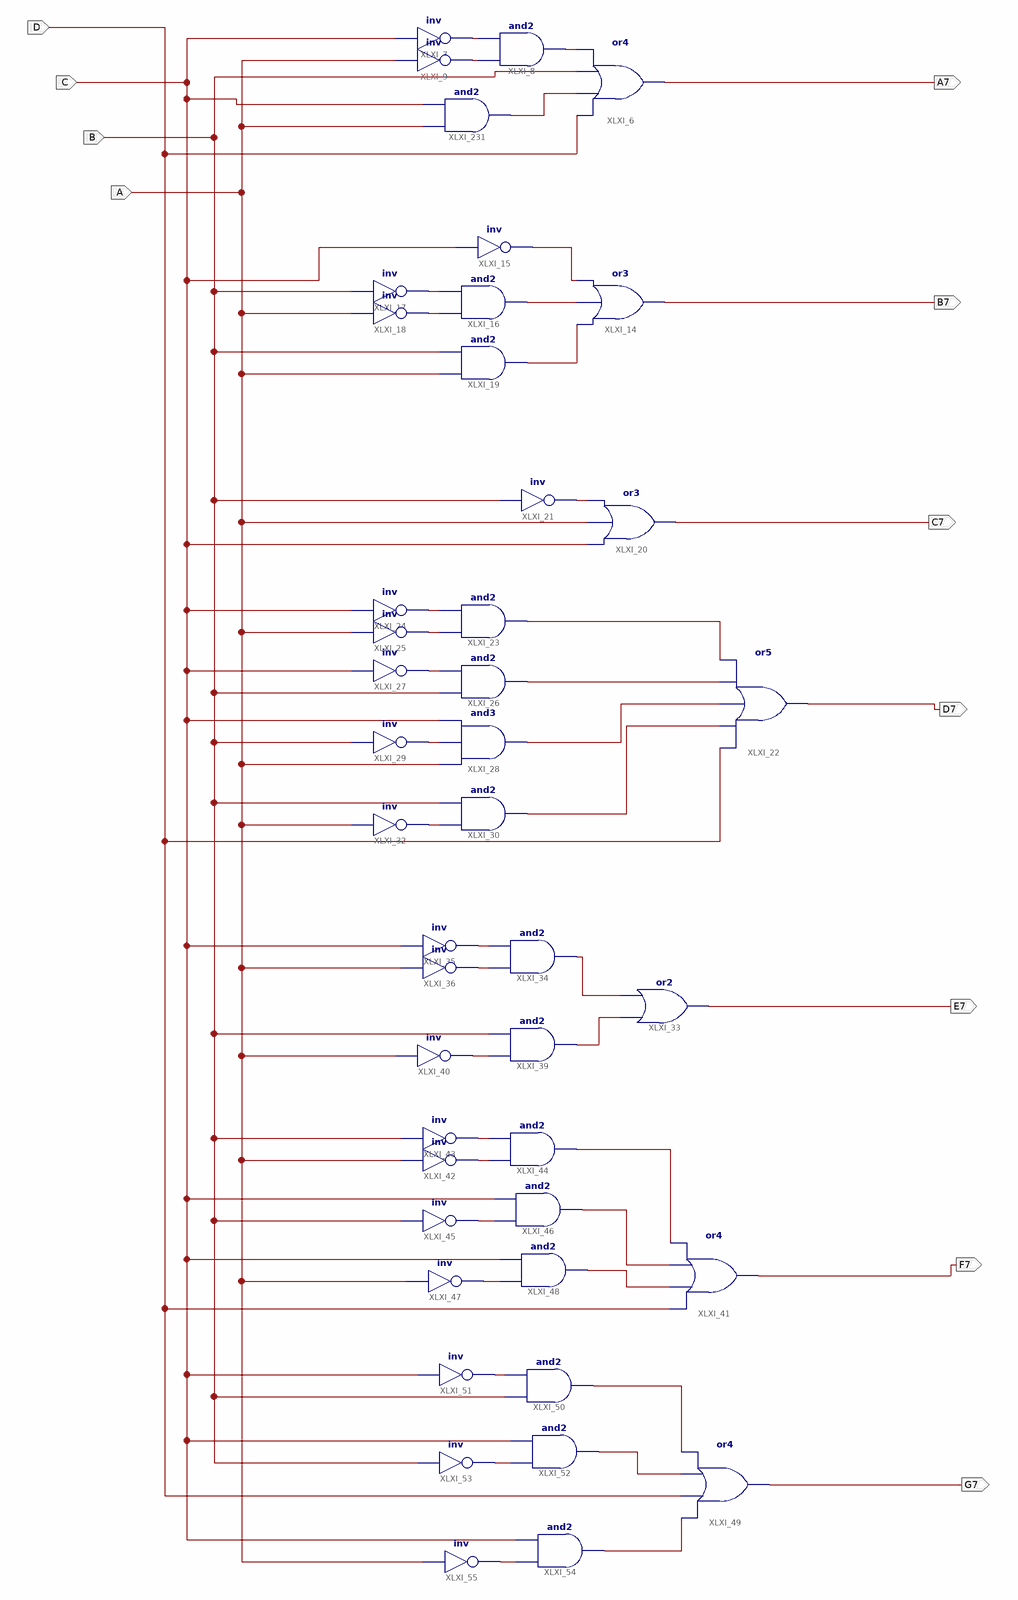
[diagram p0: schematic sheet 1]
// Xilinx ISE schematic NewBcdTo7Seg.sch (spartan6) as structural Verilog: 44 symbols, 11 ports
module NewBcdTo7Seg (
  input  D,
  input  C,
  input  B,
  input  A,
  output A7,
  output B7,
  output C7,
  output D7,
  output E7,
  output F7,
  output G7
);

  wire XLXN_5, XLXN_8, XLXN_9, XLXN_15, XLXN_18, XLXN_19, XLXN_20, XLXN_21, XLXN_22, XLXN_24, XLXN_29,
       XLXN_30, XLXN_31, XLXN_32, XLXN_34, XLXN_38, XLXN_39, XLXN_40, XLXN_41, XLXN_44, XLXN_45, XLXN_46,
       XLXN_51, XLXN_52, XLXN_54, XLXN_55, XLXN_56, XLXN_57, XLXN_58, XLXN_61, XLXN_62, XLXN_64, XLXN_65,
       XLXN_66, XLXN_68, XLXN_69, XLXN_70;

  or XLXI_6 (A7, D, XLXN_15, B, XLXN_5);
  and XLXI_8 (XLXN_5, XLXN_9, XLXN_8);
  not XLXI_7 (XLXN_8, C);
  not XLXI_9 (XLXN_9, A);
  or XLXI_14 (B7, XLXN_22, XLXN_21, XLXN_18);
  not XLXI_15 (XLXN_18, C);
  and XLXI_16 (XLXN_21, XLXN_20, XLXN_19);
  not XLXI_17 (XLXN_19, B);
  not XLXI_18 (XLXN_20, A);
  and XLXI_19 (XLXN_22, A, B);
  or XLXI_20 (C7, C, A, XLXN_24);
  not XLXI_21 (XLXN_24, B);
  and XLXI_23 (XLXN_31, XLXN_30, XLXN_29);
  not XLXI_24 (XLXN_29, C);
  not XLXI_25 (XLXN_30, A);
  and XLXI_26 (XLXN_34, B, XLXN_32);
  not XLXI_27 (XLXN_32, C);
  or XLXI_22 (D7, D, XLXN_40, XLXN_39, XLXN_34, XLXN_31);
  and XLXI_28 (XLXN_39, A, XLXN_38, C);
  not XLXI_29 (XLXN_38, B);
  and XLXI_30 (XLXN_40, XLXN_41, B);
  not XLXI_32 (XLXN_41, A);
  and XLXI_34 (XLXN_46, XLXN_45, XLXN_44);
  not XLXI_35 (XLXN_44, C);
  not XLXI_36 (XLXN_45, A);
  or XLXI_33 (E7, XLXN_52, XLXN_46);
  and XLXI_39 (XLXN_52, XLXN_51, B);
  not XLXI_40 (XLXN_51, A);
  not XLXI_42 (XLXN_55, A);
  not XLXI_43 (XLXN_54, B);
  and XLXI_44 (XLXN_56, XLXN_55, XLXN_54);
  not XLXI_45 (XLXN_57, B);
  and XLXI_46 (XLXN_62, XLXN_57, C);
  not XLXI_47 (XLXN_58, A);
  and XLXI_48 (XLXN_61, XLXN_58, C);
  or XLXI_41 (F7, D, XLXN_61, XLXN_62, XLXN_56);
  or XLXI_49 (G7, XLXN_70, D, XLXN_69, XLXN_68);
  and XLXI_50 (XLXN_68, B, XLXN_64);
  not XLXI_51 (XLXN_64, C);
  and XLXI_52 (XLXN_69, XLXN_65, C);
  not XLXI_53 (XLXN_65, B);
  and XLXI_54 (XLXN_70, XLXN_66, C);
  not XLXI_55 (XLXN_66, A);
  and XLXI_231 (XLXN_15, A, C);
endmodule
